# Altium project Luchador Rev 3.2.PrjPcb (part 4 of 4)

## Sheet 8CH EEG.SchDoc
size B; SheetNumber: 6; SheetTotal: 11; TitleBlk1Sch: PCBA, LUCHADOR, REV 3.2b, AMBER; TitleBlk2Sch: 8CH EEG; RevSch: 01; Eng: Haman; EngDate: 3-15-19
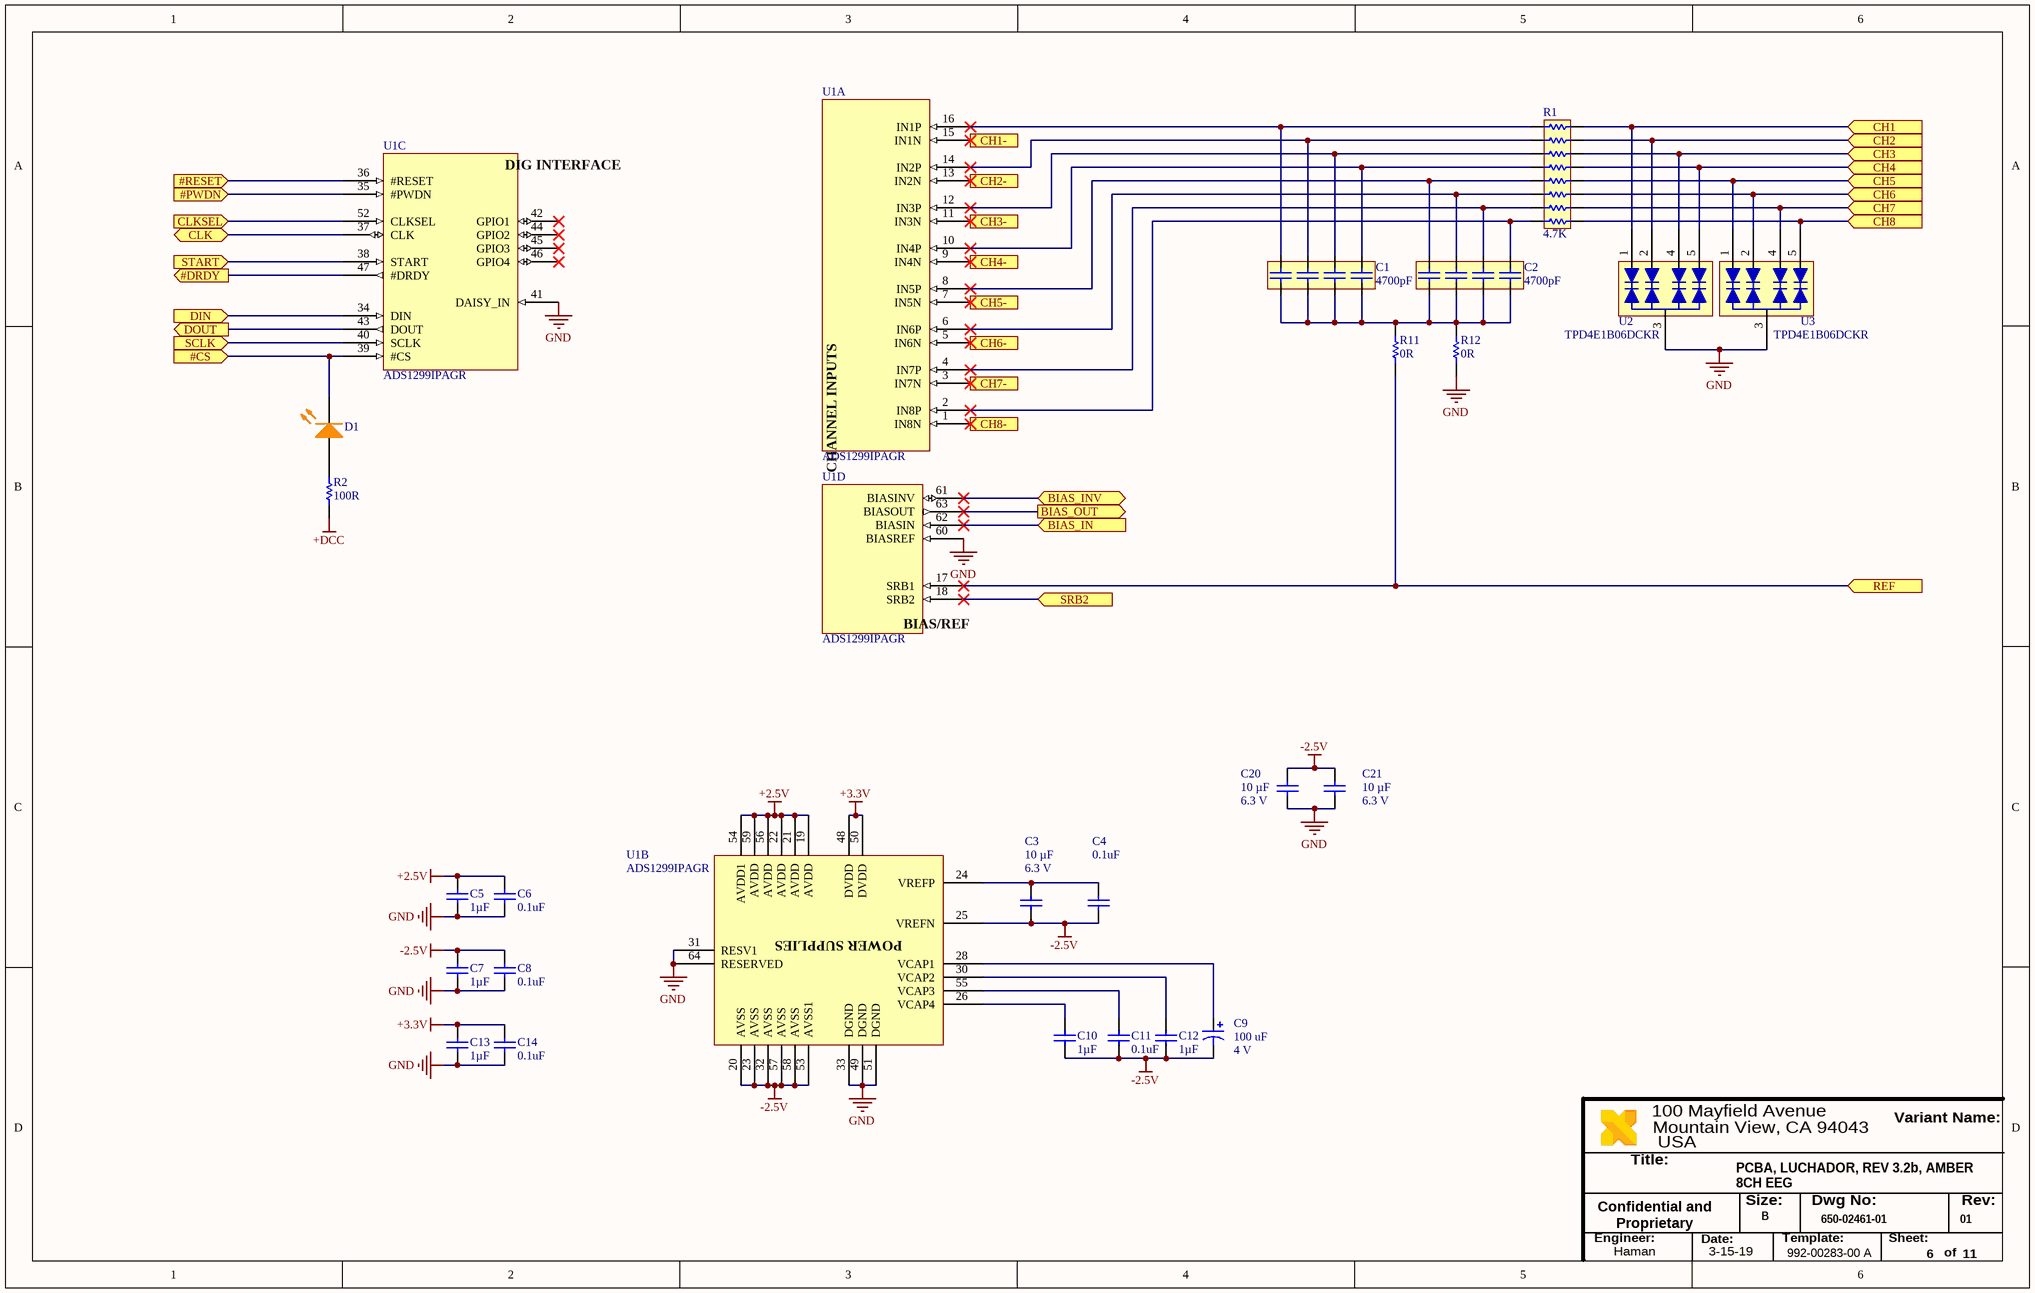
[diagram p6: 8CH EEG.SchDoc]

### Parts
C1  Capacitance: 4700pF  [1206C-ARRAY]  (hidden comment: 50V)
C2  Capacitance: 4700pF  [1206C-ARRAY]  (hidden comment: 50V)
C3  Capacitance: 10 µF  Rated Voltage: 6.3 V  [0603C]  (hidden comment: 50V)
C4  Capacitance: 0.1uF  [0402C]  (hidden comment: 50V)
C5  Capacitance: 1µF  [0402C]  (hidden comment: 50V)
C6  Capacitance: 0.1uF  [0402C]  (hidden comment: 50V)
C7  Capacitance: 1µF  [0402C]  (hidden comment: 50V)
C8  Capacitance: 0.1uF  [0402C]  (hidden comment: 50V)
C9  Capacitance: 100 uF  Voltage Rating: 4 V  [1411T]  (hidden comment: Cap Pol1)
C10  Capacitance: 1µF  [0402C]  (hidden comment: 50V)
C11  Capacitance: 0.1uF  [0402C]  (hidden comment: 50V)
C12  Capacitance: 1µF  [0402C]  (hidden comment: 50V)
C13  Capacitance: 1µF  [0402C]  (hidden comment: 50V)
C14  Capacitance: 0.1uF  [0402C]  (hidden comment: 50V)
C20  Capacitance: 10 µF  Rated Voltage: 6.3 V  [0603C]  (hidden comment: 50V)
C21  Capacitance: 10 µF  Rated Voltage: 6.3 V  [0603C]  (hidden comment: 50V)
D1  LED0_1  [0402L-ORANGE]  (value not drawn)
R1  Resistance: 4.7K  [1506R]  (hidden comment: RES 8X)
R2  Resistance: 100R  [0402R]  (hidden comment: Res 0805)
R11  Resistance (Ohms): 0R  [0402R]  (hidden comment: Res 0805)
R12  Resistance (Ohms): 0R  [0402R]  (hidden comment: Res 0805)
U1  ADS1299IPAGR  [TQFP-64]  (parts A,B,C,D of 4)
U2  TPD4E1B06DCKR  [SC70-6]
U3  TPD4E1B06DCKR  [SC70-6]

### Ports
#CS (in), #DRDY (out), #PWDN (in), #RESET (in), BIAS_IN (in), BIAS_INV (bidir), BIAS_OUT (out), CH1 (in), CH1- (in), CH2 (in), CH2- (in), CH3 (in), CH3- (in), CH4 (in), CH4- (in), CH5 (in), CH5- (in), CH6 (in), CH6- (in), CH7 (in), CH7- (in), CH8 (in), CH8- (in), CLK (bidir), CLKSEL (in), DIN (in), DOUT (out), REF (in), SCLK (in), SRB2 (in), START (in)

### Nets
+2.5V: C5.1 C6.1 U1.19(AVDD) U1.21(AVDD) U1.22(AVDD) U1.54(AVDD1) U1.56(AVDD) U1.59(AVDD)
+3.3V: C13.1 C14.1 U1.48(DVDD) U1.50(DVDD)
+DCC: R2.1
-2.5V: C3.2 C4.2 C7.1 C8.1 C9.2 C10.2 C11.2 C12.2 C20.1 C21.1 U1.20(AVSS) U1.23(AVSS) U1.25(VREFN) U1.32(AVSS) U1.53(AVSS1) U1.57(AVSS) U1.58(AVSS)
GND: C5.2 C6.2 C7.2 C8.2 C13.2 C14.2 C20.2 C21.2 R12.1 U1.31(RESV1) U1.33(DGND) U1.41(DAISY_IN) U1.49(DGND) U1.51(DGND) U1.60(BIASREF) U1.64(RESERVED) U2.3(GND) U3.3(GND)
#DRDY: U1.47(#DRDY) ; port #DRDY
#PWDN: U1.35(#PWDN) ; port #PWDN
#RESET: U1.36(#RESET) ; port #RESET
START: U1.38(START) ; port START
NetC1_A1: C1.A1 R1.A1 U1.16(IN1P)
NetC1_A2: C1.A2 R1.A2 U1.14(IN2P)
NetC1_A3: C1.A3 R1.A3 U1.12(IN3P)
NetC1_A4: C1.A4 R1.A4 U1.10(IN4P)
NetC1_B1: C1.B1 C1.B2 C1.B3 C1.B4 C2.B1 C2.B2 C2.B3 C2.B4 R11.2 R12.2
NetC2_A1: C2.A1 R1.A5 U1.8(IN5P)
NetC2_A2: C2.A2 R1.A6 U1.6(IN6P)
NetC2_A3: C2.A3 R1.A7 U1.4(IN7P)
NetC2_A4: C2.A4 R1.A8 U1.2(IN8P)
NetC3_1: C3.1 C4.1 U1.24(VREFP)
NetC9_1: C9.1 U1.28(VCAP1)
NetC10_1: C10.1 U1.26(VCAP4)
NetC11_1: C11.1 U1.55(VCAP3)
NetC12_1: C12.1 U1.30(VCAP2)
NetD1_1: D1.1(A) R2.2
NetD1_2: D1.2(K) U1.39(#CS) ; port #CS
NetR1_B1: R1.B1 U2.1(IO1) ; port CH1
NetR1_B2: R1.B2 U2.2(IO2) ; port CH2
NetR1_B3: R1.B3 U2.4(IO3) ; port CH3
NetR1_B4: R1.B4 U2.5(IO4) ; port CH4
NetR1_B5: R1.B5 U3.1(IO1) ; port CH5
NetR1_B6: R1.B6 U3.2(IO2) ; port CH6
NetR1_B7: R1.B7 U3.4(IO3) ; port CH7
NetR1_B8: R1.B8 U3.5(IO4) ; port CH8
NetR11_1: R11.1 U1.17(SRB1) ; port REF
NetU1_1: U1.1(IN8N) ; port CH8-
NetU1_3: U1.3(IN7N) ; port CH7-
NetU1_5: U1.5(IN6N) ; port CH6-
NetU1_7: U1.7(IN5N) ; port CH5-
NetU1_9: U1.9(IN4N) ; port CH4-
NetU1_11: U1.11(IN3N) ; port CH3-
NetU1_13: U1.13(IN2N) ; port CH2-
NetU1_15: U1.15(IN1N) ; port CH1-
NetU1_18: U1.18(SRB2) ; port SRB2
NetU1_34: U1.34(DIN) ; port DIN
NetU1_37: U1.37(CLK) ; port CLK
NetU1_40: U1.40(SCLK) ; port SCLK
NetU1_43: U1.43(DOUT) ; port DOUT
NetU1_52: U1.52(CLKSEL) ; port CLKSEL
NetU1_61: U1.61(BIASINV) ; port BIAS_INV
NetU1_62: U1.62(BIASIN) ; port BIAS_IN
NetU1_63: U1.63(BIASOUT) ; port BIAS_OUT

Not connected (* = marked no-connect by the designer): U1 42(GPIO1)* 44(GPIO2)* 45(GPIO3)* 46(GPIO4)*

### Notes on the sheet
- Title:
- USA
- 100 Mayfield Avenue
- Mountain View, CA 94043
- Variant Name:
- Confidential and Proprietary
- Engineer:
- Date:
- Size:
- B
- Template:
- 992-00283-00 A
- Dwg No:
- Sheet:
- Rev:
- of
- (in symbol ADS1299IPAGR, part A) CHANNEL INPUTS
- (in symbol ADS1299IPAGR, part B) POWER SUPPLIES
- (in symbol ADS1299IPAGR, part C) DIG INTERFACE
- (in symbol ADS1299IPAGR, part D) BIAS/REF

### Library data of the parts
C1 C2 = Cap: CAP .1UF 50V CERAMIC Y5V 0805; Manufacturer: TDK; PCN Part Number: MLCC Part Number Change 30/Nov/2012; Manufacturer Part Number: CKCA43X7R1H472M100AA; Description1: Cap Ceramic Array 0.0047uF 50V X7R 20% 1206 SMD 4 Capacitor 125C Plastic T/R; Product Training Modules: CKC Series Array Capacitor Family; Catalog Drawings: CKC 1206 Series CKC 1206 Series Footprint; Featured Product: CKC Series; Tolerance: ±20%; Number of Capacitors: 4; Circuit Type: Isolated; Temperature Coefficient: X7R; Other Names: 445-1853-1; Revision: July-2002: Re-released for DXP Platform.; Supplier 1: Digi-Key; Supplier Part Number 1: 445-1853-1-ND; Stock 1: 155348; Pricing 1: 1=0.33, 10=0.228, 100=0.129, 500=0.0911, 1000=0.0797 (USD); RoHS Information: RoHS Certificate-MLCC; Standard Package: 1; Category: Capacitors; Family: Capacitor Arrays; Series: CKC; Packaging: Cut Tape (CT); Voltage - Rated: 50V; Dielectric Material: Ceramic; Mounting Type: Surface Mount; Package / Case: 1206 (3216 Metric); Size / Dimension: 0.126" L x 0.063" W (3.20mm x 1.60mm); Height - Seated (Max): 0.051" (1.30mm); Ratings: -; Online Catalog: CKC Series; ComponentLink1URL: https://datasheet.ciiva.com/7615/mlccspec-commercial-array-en-7615142.pdf; ComponentLink1Description: https://datasheet.ciiva.com/7615/mlccspec-commercial-array-en-7615142.pdf; ComponentLink2URL: https://datasheet.ciiva.com/7615/mlccspec-commercial-array-en-7615147.pdf; ComponentLink2Description: https://datasheet.ciiva.com/7615/mlccspec-commercial-array-en-7615147.pdf; ComponentLink3URL: https://datasheet.ciiva.com/7615/mlccspec-commercial-array-en-7615148.pdf; ComponentLink3Description: https://datasheet.ciiva.com/7615/mlccspec-commercial-array-en-7615148.pdf; ComponentLink4URL: https://datasheet.ciiva.com/24216/ckca43x7r1h472m100aa-266209-24216735.pdf; ComponentLink4Description: https://datasheet.ciiva.com/24216/ckca43x7r1h472m100aa-266209-24216735.pdf
C3 C20 C21 = Cap: CAP .1UF 50V CERAMIC Y5V 0805; Manufacturer: Samsung; Manufacturer Part Number: CL10B106MQ8NRNC; Description1: 10µF ±20% 6.3V X7R Ceramic Capacitor -55°C ~ 125°C Surface Mount, MLCC 0603 (1608 Metric) 0.063" L x 0.031" W (1.60mm x 0.80mm); Dielectric: X7R; Tolerance (%): ±20 %; Revision: July-2002: Re-released for DXP Platform.; Supplier 1: Digi-Key; Supplier Part Number 1: 1276-1948-1-ND; Stock 1: 40000; Pricing 1: 1=1.07, 10=0.813, 100=0.5813, 500=0.45, 1000=0.3875 (USD); Case Size/Dimension: 0603; ComponentLink1URL: https://datasheet.ciiva.com/25723/cl10b106mq8nrnc-25723233.pdf; ComponentLink1Description: https://datasheet.ciiva.com/25723/cl10b106mq8nrnc-25723233.pdf; ComponentLink2URL: https://datasheet.ciiva.com/16428/cl10b106mq8nrnc-16428858.pdf; ComponentLink2Description: https://datasheet.ciiva.com/16428/cl10b106mq8nrnc-16428858.pdf
C4 C6 C8 C11 C14 = Cap: CAP .1UF 50V CERAMIC Y5V 0805; Manufacturer: Kyocera AVX; Manufacturer Part Number: 0402YD104KAT2A; Description1: AVX   0402YD104KAT2A   Multilayer Ceramic Capacitor, 0.1 F,  10%, X5R, 16 V, 0402 [1005 Metric]; Dielectric: X5R; Tolerance (%): ±10 %; Rated Voltage: 16 V; Revision: July-2002: Re-released for DXP Platform.; Supplier 1: Digi-Key; Supplier Part Number 1: 478-1126-1-ND; Stock 1: 0; Pricing 1: 1=0.1, 10=0.047, 100=0.0211, 500=0.0151, 1000=0.0119, 2500=0.0108, 5000=0.0099 (USD); Case Size/Dimension: 0402; ComponentLink1URL: https://datasheet.ciiva.com/2987/cx5r-2987712.pdf; ComponentLink1Description: https://datasheet.ciiva.com/2987/cx5r-2987712.pdf; ComponentLink2URL: https://datasheet.ciiva.com/150/cx5r-150353.pdf; ComponentLink2Description: https://datasheet.ciiva.com/150/cx5r-150353.pdf; ComponentLink3URL: https://datasheet.ciiva.com/150/cx5r-150354.pdf; ComponentLink3Description: https://datasheet.ciiva.com/150/cx5r-150354.pdf; ComponentLink4URL: https://datasheet.ciiva.com/11786/0900766b80def1a5-11786866.pdf; ComponentLink4Description: https://datasheet.ciiva.com/11786/0900766b80def1a5-11786866.pdf; ComponentLink5URL: https://datasheet.ciiva.com/150/cx5r-150355.pdf; ComponentLink5Description: https://datasheet.ciiva.com/150/cx5r-150355.pdf; ComponentLink6URL: https://datasheet.ciiva.com/1124/1666675-1124009.pdf; ComponentLink6Description: https://datasheet.ciiva.com/1124/1666675-1124009.pdf; ComponentLink7URL: https://datasheet.ciiva.com/5423/cx5r-33896-5423625.pdf; ComponentLink7Description: https://datasheet.ciiva.com/5423/cx5r-33896-5423625.pdf; ComponentLink8URL: https://datasheet.ciiva.com/1124/1666675-1124010.pdf; ComponentLink8Description: https://datasheet.ciiva.com/1124/1666675-1124010.pdf; ComponentLink9URL: https://datasheet.ciiva.com/14590/70001028-14590205.pdf; ComponentLink9Description: https://datasheet.ciiva.com/14590/70001028-14590205.pdf; ComponentLink10URL: https://datasheet.ciiva.com/14592/70001028-14592157.pdf; ComponentLink10Description: https://datasheet.ciiva.com/14592/70001028-14592157.pdf; ComponentLink11URL: https://datasheet.ciiva.com/16623/cx5r-16623293.pdf; ComponentLink11Description: https://datasheet.ciiva.com/16623/cx5r-16623293.pdf; ComponentLink12URL: https://datasheet.ciiva.com/34303/1928960-34303277.pdf; ComponentLink12Description: https://datasheet.ciiva.com/34303/1928960-34303277.pdf; ComponentLink13URL: https://datasheet.ciiva.com/2987/cx5r-2987711.pdf; ComponentLink13Description: https://datasheet.ciiva.com/2987/cx5r-2987711.pdf
C5 C7 C10 C12 C13 = Cap: CAP .1UF 50V CERAMIC Y5V 0805; Manufacturer: TDK; Manufacturer Part Number: CGB2A1JB1C105K033BC; PCN Part Number: MLCC Part Number Change 30/Nov/2012; Description1: 1µF ±10% 16V JB Ceramic Capacitor -25°C ~ 85°C Surface Mount, MLCC 0402 (1005 Metric) 0.039" L x 0.020" W (1.00mm x 0.50mm); Product Training Modules: SEAT, CCV, and TVCL Design Tools Guide to Replacing an Electrolytic Capacitor with an MLCC; Featured Product: CGB Series Capacitors CH and JB Temperature Coefficient Capacitors; EDA / CAD Models: Download from Accelerated Designs; Tolerance: ±10%; Voltage - Rated: 16V; Temperature Coefficient: JB; Online Catalog: CGB Series; Other Names: 445-12011-6; Revision: July-2002: Re-released for DXP Platform.; Supplier 1: Digi-Key; Supplier Part Number 1: 445-12011-1-ND; Stock 1: 7430; Pricing 1: 1=0.22, 10=0.151, 100=0.0765, 500=0.0523, 1000=0.0463, 2500=0.0443, 5000=0.0403 (USD); RoHS Information: RoHS Certificate-MLCC; Standard Package: 1; Category: Capacitors; Family: Ceramic Capacitors; Series: CGB; Packaging: Digi-Reel®; Mounting Type: Surface Mount, MLCC; Operating Temperature: -25°C ~ 85°C; Applications: General Purpose; Package / Case: 0402 (1005 Metric); Size / Dimension: 0.039" L x 0.020" W (1.00mm x 0.50mm); Thickness (Max): 0.013" (0.33mm); Features: Low Profile; ComponentLink1URL: https://product.tdk.com/info/en/catalog/datasheets/mlcc_commercial_lowprofile_en.pdf; ComponentLink1Description: https://product.tdk.com/info/en/catalog/datasheets/mlcc_commercial_lowprofile_en.pdf; ComponentLink2URL: https://product.tdk.com/info/en/catalog/spec/mlccspec_commercial_lowprofile_en.pdf; ComponentLink2Description: https://product.tdk.com/info/en/catalog/spec/mlccspec_commercial_lowprofile_en.pdf; ComponentLink3URL: http://product.tdk.com/en/catalog/datasheets/mlcc_commercial_lowprofile_en.pdf; ComponentLink3Description: http://product.tdk.com/en/catalog/datasheets/mlcc_commercial_lowprofile_en.pdf
C9 = Cap Pol1: Polarized Capacitor (Radial); Manufacturer: KEMET; Manufacturer Part Number: T520T107M004ATE070; Mfr Case Code: T Case; Description1: CAP TANT POLY 100UF 4V 1411; Tolerance: 20 %; ESR: 70 mOhms; Case Length: 3.5 mm; Case Width: 2.8 mm; Type: Conductive Polymer Chip Capacitors; Supplier 1: Digi-Key; Supplier Part Number 1: 399-5289-1-ND; Stock 1: 31834; Pricing 1: 1=1.61, 10=1.268, 100=0.9509, 500=0.7185, 1000=0.6339 (USD); Dimensions: 2.8 mm W x 3.5 mm L; Product Category: Tantalum Capacitors - Polymer SMD; RoHS: Details; Brand: Kemet; Case Code - in: 1411; Case Code - mm: 6032; Height: 1.2 mm; Operating Temperature Range: - 55 C to + 105 C; Package / Case: 1411 (3528 metric); Packaging: Reel; Product: Tantalum Organic Polymer Low ESR; Series: T520, PSL; Factory Pack Quantity: 2500; Termination Style: SMD/SMT; Tradename: KO-CAP; Voltage Rating DC: 4 V; ComponentLink1URL: https://datasheet.ciiva.com/260/kem-t2015-t520-260217.pdf; ComponentLink1Description: https://datasheet.ciiva.com/260/kem-t2015-t520-260217.pdf; ComponentLink2URL: https://datasheet.ciiva.com/260/kem-t2015-t520-260218.pdf; ComponentLink2Description: https://datasheet.ciiva.com/260/kem-t2015-t520-260218.pdf; ComponentLink3URL: https://datasheet.ciiva.com/260/kem-t2015-t520-260219.pdf; ComponentLink3Description: https://datasheet.ciiva.com/260/kem-t2015-t520-260219.pdf
D1 = LED0_1: Typical INFRARED GaAs LED; Manufacturer: Vishay; Manufacturer Part Number: VLMO1500-GS08; Description1: Standard LEDs - SMD 0402 SOFT ORANGE Non-Diff; Illumination Color: Orange; Wavelength/Color Temperature: 605 nm; Luminous Intensity: 90 mcd; Viewing Angle: 130 deg; Lens Color/Style: Water Clear; If - Forward Current: 30 mA; Vf - Forward Voltage: 2 V; Power Rating: 75 mW; Brand: Vishay Semiconductors; Supplier 1: Digi-Key; Supplier Part Number 1: VLMO1500-GS08CT-ND; Stock 1: 194938; Pricing 1: 1=0.53, 10=0.38, 25=0.2916, 100=0.1901, 250=0.1394, 500=0.1183, 1000=0.0972 (USD); Product Category: Standard LEDs - SMD; RoHS: True; Package / Case: 0402 (1005 metric); Length: 1 mm; Height: 0.35 mm; Width: 0.5 mm; Minimum Operating Temperature: - 30 C; Maximum Operating Temperature: + 85 C; Series: VLMx; Packaging: Reel; Mounting Style: SMD/SMT; Factory Pack Quantity: 9000; Tradename: ChipLED; ComponentLink1URL: https://datasheet.ciiva.com/13945/vlmo1500-13945355.pdf; ComponentLink1Description: https://datasheet.ciiva.com/13945/vlmo1500-13945355.pdf; ComponentLink2URL: https://datasheet.ciiva.com/13945/vlmo1500-13945356.pdf; ComponentLink2Description: https://datasheet.ciiva.com/13945/vlmo1500-13945356.pdf; ComponentLink3URL: https://datasheet.ciiva.com/13945/vlmo1500-13945357.pdf; ComponentLink3Description: https://datasheet.ciiva.com/13945/vlmo1500-13945357.pdf
R1 = RES 8X: Resistor; Manufacturer: Panasonic; Manufacturer Part Number: EXB-2HV472JV; Description1: Res Thick Film Array 4.7K Ohm 5% 1/4W ±200ppm/°C ISOL 16-Pin 1506(8 X 0402) Convex SMD Punched Carrier T/R; No of Elements: 8; Tolerance (%): ±5 %; Power Dissipation: 0.063 W; Voltage Rating: 50 V; Supplier 1: Digi-Key; Supplier Part Number 1: Y1472CT-ND; Stock 1: 49295; Pricing 1: 1=0.29, 10=0.248, 25=0.1804, 50=0.1308, 100=0.097, 250=0.0744, 500=0.0586, 1000=0.0406 (USD); Case Size: 0402 (1005 Metric); ComponentLink1URL: https://datasheet.ciiva.com/19466/1387876-19466987.pdf; ComponentLink1Description: https://datasheet.ciiva.com/19466/1387876-19466987.pdf; ComponentLink2URL: https://datasheet.ciiva.com/28636/1790599-28636958.pdf; ComponentLink2Description: https://datasheet.ciiva.com/28636/1790599-28636958.pdf; ComponentLink3URL: https://datasheet.ciiva.com/30089/aoc0000ce1-30089086.pdf; ComponentLink3Description: https://datasheet.ciiva.com/30089/aoc0000ce1-30089086.pdf
R2 = Res 0805: Resistor; Manufacturer: Panasonic; Manufacturer Part Number: ERJ-2RKF1000X; Description1: Res Thick Film 0402 100 Ohm 1% 0.1W(1/10W) ±100ppm/C Molded SMD Automotive T/R; Rated Power: 0.1 W; Tolerance (%): ±1 %; Temp Coefficient: ±100 ppm/°C; Supplier 1: Digi-Key; Supplier Part Number 1: P100LCT-ND; Stock 1: 14075966; Pricing 1: 1=0.1, 10=0.056, 100=0.0227, 1000=0.0102, 2500=0.0089, 5000=0.0073 (USD); Size Code: 0402; ComponentLink1URL: https://datasheet.ciiva.com/27056/2007311-27056035.pdf; ComponentLink1Description: https://datasheet.ciiva.com/27056/2007311-27056035.pdf; ComponentLink2URL: https://datasheet.ciiva.com/11821/0900766b80f80784-11821173.pdf; ComponentLink2Description: https://datasheet.ciiva.com/11821/0900766b80f80784-11821173.pdf; ComponentLink3URL: https://datasheet.ciiva.com/46372/1678782-46372741.pdf; ComponentLink3Description: https://datasheet.ciiva.com/46372/1678782-46372741.pdf; ComponentLink4URL: https://datasheet.ciiva.com/16199/aoa0000ce2-16199575.pdf; ComponentLink4Description: https://datasheet.ciiva.com/16199/aoa0000ce2-16199575.pdf; ComponentLink5URL: https://datasheet.ciiva.com/43467/1678782-43467223.pdf; ComponentLink5Description: https://datasheet.ciiva.com/43467/1678782-43467223.pdf; ComponentLink6URL: https://datasheet.ciiva.com/30260/aoa0000ce2-30260809.pdf; ComponentLink6Description: https://datasheet.ciiva.com/30260/aoa0000ce2-30260809.pdf; ComponentLink7URL: https://datasheet.ciiva.com/9186/aoa0000ce2-9186683.pdf; ComponentLink7Description: https://datasheet.ciiva.com/9186/aoa0000ce2-9186683.pdf; ComponentLink8URL: https://datasheet.ciiva.com/16776/70260748-16776427.pdf; ComponentLink8Description: https://datasheet.ciiva.com/16776/70260748-16776427.pdf; ComponentLink9URL: https://datasheet.ciiva.com/48531/aoa0000ce2-48531067.pdf; ComponentLink9Description: https://datasheet.ciiva.com/48531/aoa0000ce2-48531067.pdf; ComponentLink10URL: https://datasheet.ciiva.com/17207/aoa0000ce2-17207980.pdf; ComponentLink10Description: https://datasheet.ciiva.com/17207/aoa0000ce2-17207980.pdf; ComponentLink11URL: https://datasheet.ciiva.com/7830/426256-7830973.pdf; ComponentLink11Description: https://datasheet.ciiva.com/7830/426256-7830973.pdf; ComponentLink12URL: https://datasheet.ciiva.com/16522/aoa0000ce2-16522621.pdf; ComponentLink12Description: https://datasheet.ciiva.com/16522/aoa0000ce2-16522621.pdf; ComponentLink13URL: https://datasheet.ciiva.com/28514/1678782-28514175.pdf; ComponentLink13Description: https://datasheet.ciiva.com/28514/1678782-28514175.pdf
R11 R12 = Res 0805: Resistor; Manufacturer: Panasonic; Manufacturer Part Number: ERJ-2GE0R00X; Description1: Res Thick Film 0402 0 Ohm Molded SMD Automotive T/R; EDA / CAD Models: Download from Accelerated Designs; Tolerance: Jumper; Power (Watts): 0.1W, 1/10W; Online Catalog: ERJ Series; Other Names: P0.0JDKR; Supplier 1: Digi-Key; Supplier Part Number 1: P0.0JCT-ND; Stock 1: 31263960; Pricing 1: 1=0.1, 10=0.037, 25=0.0268, 50=0.0204, 100=0.015, 250=0.0114, 500=0.0091, 1000=0.0067, 5000=0.0048 (USD); Standard Package: 1; Category: Resistors; Family: Chip Resistor - Surface Mount; Series: ERJ; Packaging: Digi-Reel®; Composition: Thick Film; Features: Automotive AEC-Q200; Temperature Coefficient: -; Operating Temperature: -55°C ~ 155°C; Package / Case: 0402 (1005 Metric); Supplier Device Package: 0402; Size / Dimension: 0.039" L x 0.020" W (1.00mm x 0.50mm); Height: 0.016" (0.40mm); Number of Terminations: 2; ComponentLink1URL: https://datasheet.ciiva.com/48531/aoa0000ce1-48531077.pdf; ComponentLink1Description: https://datasheet.ciiva.com/48531/aoa0000ce1-48531077.pdf; ComponentLink2URL: https://datasheet.ciiva.com/16783/70260739-16783734.pdf; ComponentLink2Description: https://datasheet.ciiva.com/16783/70260739-16783734.pdf; ComponentLink3URL: https://datasheet.ciiva.com/11821/0900766b80f806dd-11821176.pdf; ComponentLink3Description: https://datasheet.ciiva.com/11821/0900766b80f806dd-11821176.pdf; ComponentLink4URL: https://datasheet.ciiva.com/17215/aoa0000ce1-17215386.pdf; ComponentLink4Description: https://datasheet.ciiva.com/17215/aoa0000ce1-17215386.pdf; ComponentLink5URL: https://datasheet.ciiva.com/43460/1678796-43460347.pdf; ComponentLink5Description: https://datasheet.ciiva.com/43460/1678796-43460347.pdf; ComponentLink6URL: https://datasheet.ciiva.com/5959/1678796-5959692.pdf; ComponentLink6Description: https://datasheet.ciiva.com/5959/1678796-5959692.pdf; ComponentLink7URL: https://datasheet.ciiva.com/30097/4aoa0000ce1-30097116.pdf; ComponentLink7Description: https://datasheet.ciiva.com/30097/4aoa0000ce1-30097116.pdf; ComponentLink8URL: https://datasheet.ciiva.com/28695/1678796-28695758.pdf; ComponentLink8Description: https://datasheet.ciiva.com/28695/1678796-28695758.pdf; ComponentLink9URL: https://datasheet.ciiva.com/46389/1678796-46389518.pdf; ComponentLink9Description: https://datasheet.ciiva.com/46389/1678796-46389518.pdf; ComponentLink10URL: https://datasheet.ciiva.com/16778/70260739-16778335.pdf; ComponentLink10Description: https://datasheet.ciiva.com/16778/70260739-16778335.pdf
U1 = ADS1299IPAGR: Manufacturer: Texas Instruments; Description1: IC AFE 24BIT 16KSPS LN 64TQFP; Number of Bits: 24; Number of Channels: 8; Power (Watts): 42mW; Voltage - Supply, Analog: 5V; Voltage - Supply, Digital: 1.8 V ~ 3.6 V; Supplier 1: Digi-Key; Supplier Part Number 1: 296-34818-1-ND; RoHS: RoHS Compliant; Category: Integrated Circuits (ICs); Stock 1: 1324; Pricing 1: 1=55.08, 10=51.84, 100=46.332, 500=43.416, 1000=40.5 (USD); Packaging: Cut Tape (CT); Part Status: Active; Package / Case: 64-TQFP; Supplier Device Package: 64-TQFP (10x10); ComponentLink1URL: http://www.ti.com/lit/ds/symlink/ads1299.pdf; ComponentLink1Description: http://www.ti.com/lit/ds/symlink/ads1299.pdf; Manufacturer Part Number: ADS1299IPAGR
U2 U3 = TPD4E1B06DCKR: Manufacturer: Texas Instruments; Description1: TVS DIODE 5.5VWM 14.5VC SC70-6; Direction Type: Uni-Directional; Maximum Clamping Voltage: 15(Typ) V; Number of Elements per Chip: 4; ESD Protection Voltage: ±18@Air Gap/±18@Contact Disc kV; Maximum Working Voltage: 5.5 V; Maximum Leakage Current: 0.01 uA; Capacitance Value: 1 pF; Supplier 1: Digi-Key; Supplier Part Number 1: 296-39346-1-ND; Stock 1: 120901; Pricing 1: 1=0.61, 10=0.519, 100=0.3876, 500=0.3046, 1000=0.2353 (USD); Type: Diode Arrays; Pin Count: 6; Minimum Operating Temperature: -40 °C; Maximum Operating Temperature: 125 °C; Mounting: Surface Mount; Category: ESD Suppressors; ComponentLink1URL: https://datasheet.ciiva.com/12545/tpd4e1b06-224687-12545147.pdf; ComponentLink1Description: https://datasheet.ciiva.com/12545/tpd4e1b06-224687-12545147.pdf; ComponentLink2URL: https://datasheet.ciiva.com/6574/tpd4e1b06-6574671.pdf; ComponentLink2Description: https://datasheet.ciiva.com/6574/tpd4e1b06-6574671.pdf; Manufacturer Part Number: TPD4E1B06DCKR

## Sheet Differential Channel Protection.SchDoc
size A4; SheetNumber: 7; SheetTotal: 11; TitleBlk1Sch: PCBA, LUCHADOR, REV 3.2b, AMBER; Eng: Haman; EngDate: 3-15-19; RevSch: 01; TitleBlk2Sch: Differential Channel Protection
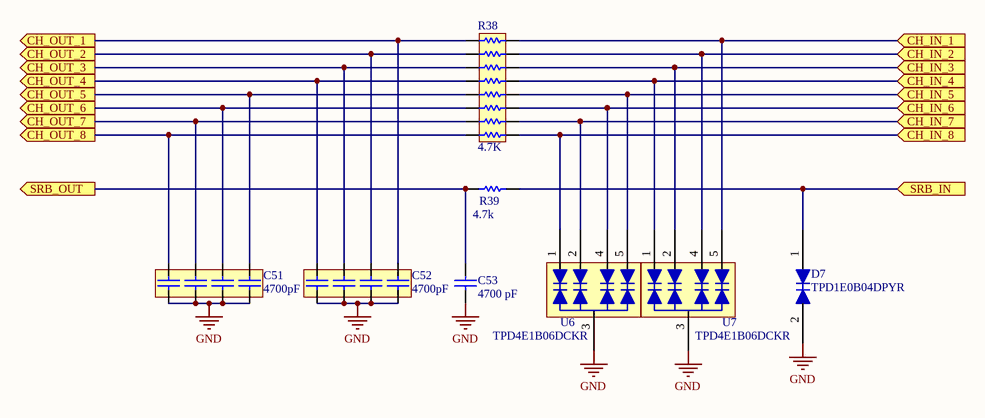
[diagram p7: Differential Channel Protection.SchDoc]

### Parts
C51  Capacitance: 4700pF  [1206C-ARRAY]  (hidden comment: 50V)
C52  Capacitance: 4700pF  [1206C-ARRAY]  (hidden comment: 50V)
C53  Capacitance: 4700 pF  [0402C]  (hidden comment: 50V)
D7  TPD1E0B04DPYR  [0402D]
R38  Resistance: 4.7K  [1506R]  (hidden comment: RES 8X)
R39  Resistance Value: 4.7k  [0402R]  (hidden comment: Res 0805)
U6  TPD4E1B06DCKR  [SC70-6]
U7  TPD4E1B06DCKR  [SC70-6]

### Ports
CH_IN_1 (in), CH_IN_2 (in), CH_IN_3 (in), CH_IN_4 (in), CH_IN_5 (in), CH_IN_6 (in), CH_IN_7 (in), CH_IN_8 (in), CH_OUT_1 (out), CH_OUT_2 (out), CH_OUT_3 (out), CH_OUT_4 (out), CH_OUT_5 (out), CH_OUT_6 (out), CH_OUT_7 (out), CH_OUT_8 (out), SRB_IN (in), SRB_OUT (out)

### Nets
GND: C51.B1 C51.B2 C51.B3 C51.B4 C52.B1 C52.B2 C52.B3 C52.B4 C53.1 D7.2(GND) U6.3(GND) U7.3(GND)
NetC51_A1: C51.A1 R38.A5 ; port CH_OUT_5
NetC51_A2: C51.A2 R38.A6 ; port CH_OUT_6
NetC51_A3: C51.A3 R38.A7 ; port CH_OUT_7
NetC51_A4: C51.A4 R38.A8 ; port CH_OUT_8
NetC52_A1: C52.A1 R38.A1 ; port CH_OUT_1
NetC52_A2: C52.A2 R38.A2 ; port CH_OUT_2
NetC52_A3: C52.A3 R38.A3 ; port CH_OUT_3
NetC52_A4: C52.A4 R38.A4 ; port CH_OUT_4
NetC53_2: C53.2 R39.1 ; port SRB_OUT
NetD7_1: D7.1(IO1) R39.2 ; port SRB_IN
NetR38_B1: R38.B1 U7.5(IO4) ; port CH_IN_1
NetR38_B2: R38.B2 U7.4(IO3) ; port CH_IN_2
NetR38_B3: R38.B3 U7.2(IO2) ; port CH_IN_3
NetR38_B4: R38.B4 U7.1(IO1) ; port CH_IN_4
NetR38_B5: R38.B5 U6.5(IO4) ; port CH_IN_5
NetR38_B6: R38.B6 U6.4(IO3) ; port CH_IN_6
NetR38_B7: R38.B7 U6.2(IO2) ; port CH_IN_7
NetR38_B8: R38.B8 U6.1(IO1) ; port CH_IN_8

### Notes on the sheet
- Title:
- USA
- 100 Mayfield Avenue
- Mountain View, CA 94043
- Variant Name:
- Confidential and Proprietary
- Engineer:
- Date:
- Size:
- A4
- Template:
- 992-00283-00 A
- Dwg No:
- Sheet:
- Rev:
- of

### Library data of the parts
C51 C52 = Cap: as C1 on sheet 8CH EEG; Revision: July-2002: Re-released for DXP Platform.; Supplier 1: Digi-Key; Supplier Part Number 1: 445-1853-1-ND; Stock 1: 155348; Pricing 1: 1=0.33, 10=0.228, 100=0.129, 500=0.0911, 1000=0.0797 (USD); RoHS Information: RoHS Certificate-MLCC; Standard Package: 1; Category: Capacitors; Family: Capacitor Arrays; Series: CKC; Packaging: Cut Tape (CT); Voltage - Rated: 50V; Dielectric Material: Ceramic; Mounting Type: Surface Mount; Package / Case: 1206 (3216 Metric); Size / Dimension: 0.126" L x 0.063" W (3.20mm x 1.60mm); Height - Seated (Max): 0.051" (1.30mm); Ratings: -; Online Catalog: CKC Series; ComponentLink1URL: https://datasheet.ciiva.com/7615/mlccspec-commercial-array-en-7615142.pdf; ComponentLink1Description: https://datasheet.ciiva.com/7615/mlccspec-commercial-array-en-7615142.pdf; ComponentLink2URL: https://datasheet.ciiva.com/7615/mlccspec-commercial-array-en-7615147.pdf; ComponentLink2Description: https://datasheet.ciiva.com/7615/mlccspec-commercial-array-en-7615147.pdf; ComponentLink3URL: https://datasheet.ciiva.com/7615/mlccspec-commercial-array-en-7615148.pdf; ComponentLink3Description: https://datasheet.ciiva.com/7615/mlccspec-commercial-array-en-7615148.pdf; ComponentLink4URL: https://datasheet.ciiva.com/24216/ckca43x7r1h472m100aa-266209-24216735.pdf; ComponentLink4Description: https://datasheet.ciiva.com/24216/ckca43x7r1h472m100aa-266209-24216735.pdf
C53 = Cap: CAP .1UF 50V CERAMIC Y5V 0805; Manufacturer: Murata; Manufacturer Part Number: GCM155R71H472KA37D; Description1: CAP CER 4700PF 50V X7R 0402; Dielectric: X7R; Tolerance (%): ±10 %; Revision: July-2002: Re-released for DXP Platform.; Supplier 1: Digi-Key; Supplier Part Number 1: 490-4915-1-ND; Stock 1: 100000; Pricing 1: 1=0.1, 10=0.047, 100=0.021, 500=0.015, 1000=0.0118, 2500=0.0107, 5000=0.0099 (USD); Case Size/Dimension: 0402; Rated Voltage: 50 V; ComponentLink1URL: https://datasheet.ciiva.com/26843/getdatasheetpartid-724237-26843665.pdf; ComponentLink1Description: https://datasheet.ciiva.com/26843/getdatasheetpartid-724237-26843665.pdf; ComponentLink2URL: https://datasheet.ciiva.com/17453/product-17453667.pdf; ComponentLink2Description: https://datasheet.ciiva.com/17453/product-17453667.pdf; ComponentLink3URL: https://datasheet.ciiva.com/2989/product-2989236.pdf; ComponentLink3Description: https://datasheet.ciiva.com/2989/product-2989236.pdf; ComponentLink4URL: https://datasheet.ciiva.com/155/product-155869.pdf; ComponentLink4Description: https://datasheet.ciiva.com/155/product-155869.pdf; ComponentLink5URL: https://datasheet.ciiva.com/16440/product-16440397.pdf; ComponentLink5Description: https://datasheet.ciiva.com/16440/product-16440397.pdf; ComponentLink6URL: https://datasheet.ciiva.com/155/product-155870.pdf; ComponentLink6Description: https://datasheet.ciiva.com/155/product-155870.pdf; ComponentLink7URL: https://datasheet.ciiva.com/155/product-155871.pdf; ComponentLink7Description: https://datasheet.ciiva.com/155/product-155871.pdf
D7 = TPD1E0B04DPYR: Manufacturer: Texas Instruments; Supplier 1: Digi-Key; Supplier Part Number 1: 296-47864-1-ND; Stock 1: 6850; Pricing 1: 1=0.43, 10=0.346, 100=0.2353, 500=0.1765, 1000=0.1324 (USD); Manufacturer Part Number: TPD1E0B04DPYR
R38 = RES 8X: as R1 on sheet 8CH EEG; Supplier 1: Digi-Key; Supplier Part Number 1: Y1472CT-ND; Stock 1: 49295; Pricing 1: 1=0.29, 10=0.248, 25=0.1804, 50=0.1308, 100=0.097, 250=0.0744, 500=0.0586, 1000=0.0406 (USD); Case Size: 0402 (1005 Metric); ComponentLink1URL: https://datasheet.ciiva.com/19466/1387876-19466987.pdf; ComponentLink1Description: https://datasheet.ciiva.com/19466/1387876-19466987.pdf; ComponentLink2URL: https://datasheet.ciiva.com/28636/1790599-28636958.pdf; ComponentLink2Description: https://datasheet.ciiva.com/28636/1790599-28636958.pdf; ComponentLink3URL: https://datasheet.ciiva.com/30089/aoc0000ce1-30089086.pdf; ComponentLink3Description: https://datasheet.ciiva.com/30089/aoc0000ce1-30089086.pdf
R39 = Res 0805: Resistor; Manufacturer: Samsung; Manufacturer Part Number: RC1005F472CS; Description1: Res Thick Film 0402 4.7K Ohm 1% 1/16W ±100ppm/C Molded SMD T/R; Tolerance: 1 %; Power Rating: 1/16 W; Case Style: Molded; Temperature Coefficient: ±100 ppm/°C; Rad Hard: No; Lead Finish: Tin; Supplier 1: Digi-Key; Supplier Part Number 1: 1276-3466-1-ND; Stock 1: 3257499; Pricing 1: 1=0.1, 10=0.021, 100=0.0087, 1000=0.0039, 2500=0.0034, 5000=0.0028 (USD); Case Size: 0402; Packaging: Tape & Reel; Type: Thick Film; Operating Temperature: -55 to 155 °C; ComponentLink1URL: https://datasheet.ciiva.com/15196/getdatasheetpartid-636616-15196228.pdf; ComponentLink1Description: https://datasheet.ciiva.com/15196/getdatasheetpartid-636616-15196228.pdf; ComponentLink2URL: https://datasheet.ciiva.com/26185/chip-resistor-150112-1-26185621.pdf; ComponentLink2Description: https://datasheet.ciiva.com/26185/chip-resistor-150112-1-26185621.pdf
U6 U7 = TPD4E1B06DCKR: as U2 on sheet 8CH EEG; Supplier 1: Digi-Key; Supplier Part Number 1: 296-39346-1-ND; Stock 1: 120901; Pricing 1: 1=0.61, 10=0.519, 100=0.3876, 500=0.3046, 1000=0.2353 (USD); Type: Diode Arrays; Pin Count: 6; Minimum Operating Temperature: -40 °C; Maximum Operating Temperature: 125 °C; Mounting: Surface Mount; Category: ESD Suppressors; ComponentLink1URL: https://datasheet.ciiva.com/12545/tpd4e1b06-224687-12545147.pdf; ComponentLink1Description: https://datasheet.ciiva.com/12545/tpd4e1b06-224687-12545147.pdf; ComponentLink2URL: https://datasheet.ciiva.com/6574/tpd4e1b06-6574671.pdf; ComponentLink2Description: https://datasheet.ciiva.com/6574/tpd4e1b06-6574671.pdf; Manufacturer Part Number: TPD4E1B06DCKR

## Nets that join several sheets
+2.5V: System (J3.25), Power Supply (R51.2 R53.2 R60.1), Microcontroller (J7.3), 8CH EEG (8 pins)
+2.5VREF: Power Supply (C75.2 R64.1 R65.2 R66.1), Microcontroller (C100.1 U13.14)
+3.3V: System (J3.27), Power Supply (11 pins), Microcontroller (15 pins), Real Time Clock (D19.1), Micro SD (C102.1 J9.4), 8CH EEG (C13.1 C14.1 U1.48 U1.50)
+DCC: Power Supply (R14.1), 8CH EEG (R2.1)
+VSYS: System (J3.28), Power Supply (6 pins), Microcontroller (J7.30)
-2.5V: System (J3.26), Power Supply (R61.2 R62.1 R63.2), Microcontroller (J7.28), 8CH EEG (17 pins)
-DCC: Power Supply (6 pins), Microcontroller (D31.2)
GND: System (18 pins), Power Supply (30 pins), Microcontroller (17 pins), Real Time Clock (C78.2 C79.1 J1.2 U12.4), Micro SD (C102.2 J9.6 U14.3), 8CH EEG (18 pins), Differential Channel Protection (12 pins)
#DRDY: Microcontroller (J7.2 U13.33), 8CH EEG (U1.47)
#PWDN: Microcontroller (J7.25 U13.28), 8CH EEG (U1.35)
#RESET: Microcontroller (J7.23 U13.32), 8CH EEG (U1.36)
NetC61_1: Power Supply (C61.1 R46.1 R47.2), Microcontroller (U13.17)
NetC67_1: Power Supply (C67.1 R49.1 R50.2), Microcontroller (U13.35)
NetC72_1: Power Supply (C72.1 R53.1 R56.2), Microcontroller (U13.11)
NetC75_1: Power Supply (C75.1 R63.1 R64.2), Microcontroller (U13.12)
SCL: Microcontroller (J7.24 R97.1 U13.20), Real Time Clock (U12.6)
SDA: Microcontroller (J7.20 R98.1 U13.21), Real Time Clock (U12.5)
SPI1_CS: Microcontroller (J7.6 U13.61), Micro SD (J9.2 U14.5)
SPI1_MISO: Microcontroller (J7.13 U13.64), Micro SD (J9.7 U14.1)
SPI1_MOSI: Microcontroller (J7.14 U13.63), Micro SD (J9.3 U14.2)
SPI1_SCK: Microcontroller (J7.10 U13.62), Micro SD (J9.5 U14.4)
START: Microcontroller (J7.9 U13.41), 8CH EEG (U1.38)

## Assembly variants
PRODUCTION: not fitted B1 C79 J2 J7 R4 R12A R12B R12C R12D
Variant of Luchador Rev 3.2 w Battery: not fitted C79 J2 J7 R4 R12A R12B R12C R12D